# EAGLE design esquema (EAGLE 9.0.0)
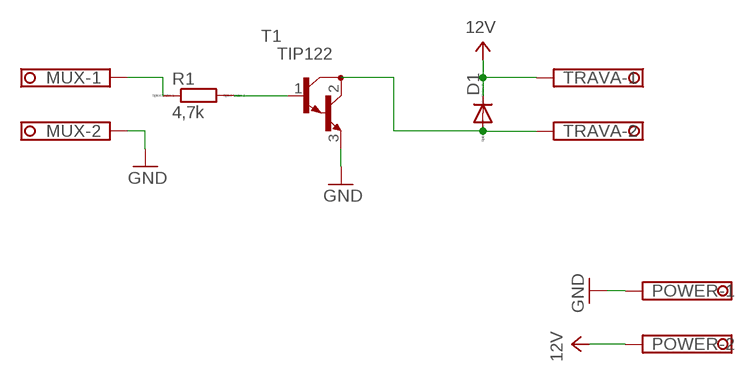
[diagram p0: schematic, sheet 1]

## Parts
D1  1N4004  [DO41-10]
MUX  TERMINAL-BLOCK-3.5MM-2-PIN-ROUND-PAD  [TERMINAL-BLOCK-2-PIN-3.5MM-ROUND-PAD]
POWER  TERMINAL-BLOCK-3.5MM-2-PIN-ROUND-PAD  [TERMINAL-BLOCK-2-PIN-3.5MM-ROUND-PAD]
R1  4,7k  R0207/10  [0207/10]
T1  TIP122  [TO220]
TRAVA  TERMINAL-BLOCK-3.5MM-2-PIN-ROUND-PAD  [TERMINAL-BLOCK-2-PIN-3.5MM-ROUND-PAD]

## Nets
12V: D1.C POWER.2 TRAVA.1
GND: MUX.2 POWER.1 T1.3(E)
N$1: D1.A T1.2(C) TRAVA.2
N$2: R1.2 T1.1(B)
N$3: MUX.1 R1.1

## Library data of the parts
D1 = diode:1N4004: DIODE general purpose rectifier, 1 A
MUX POWER TRAVA = Rembrandt Electronics - Terminal Block 3-5mm v1-0:TERMINAL-BLOCK-3.5MM-2-PIN: Terminal Block 3.5mm Pitch: 3,5 mm Number of pins: 2 Created by Rembrandt Electronics www.rembrandtelectronics.com
R1 = eagle-ltspice:R: RESISTOR, European symbol; SPICEMODEL: NONE; SPICEPREFIX: R
T1 = transistor:TIP122: NPN BIPOLAR DARLINGTON TRANSISTOR

## Board
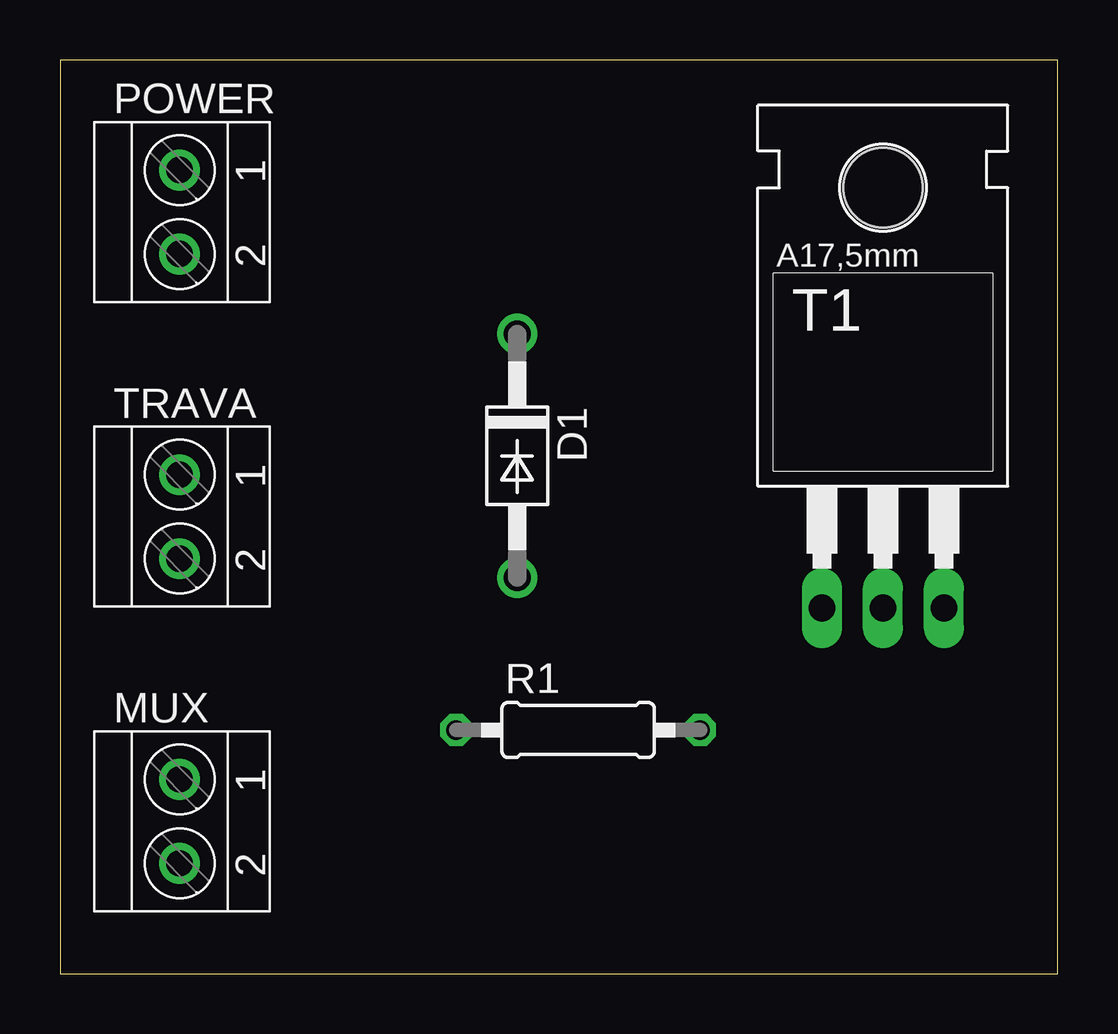
[diagram p1: board, top side]
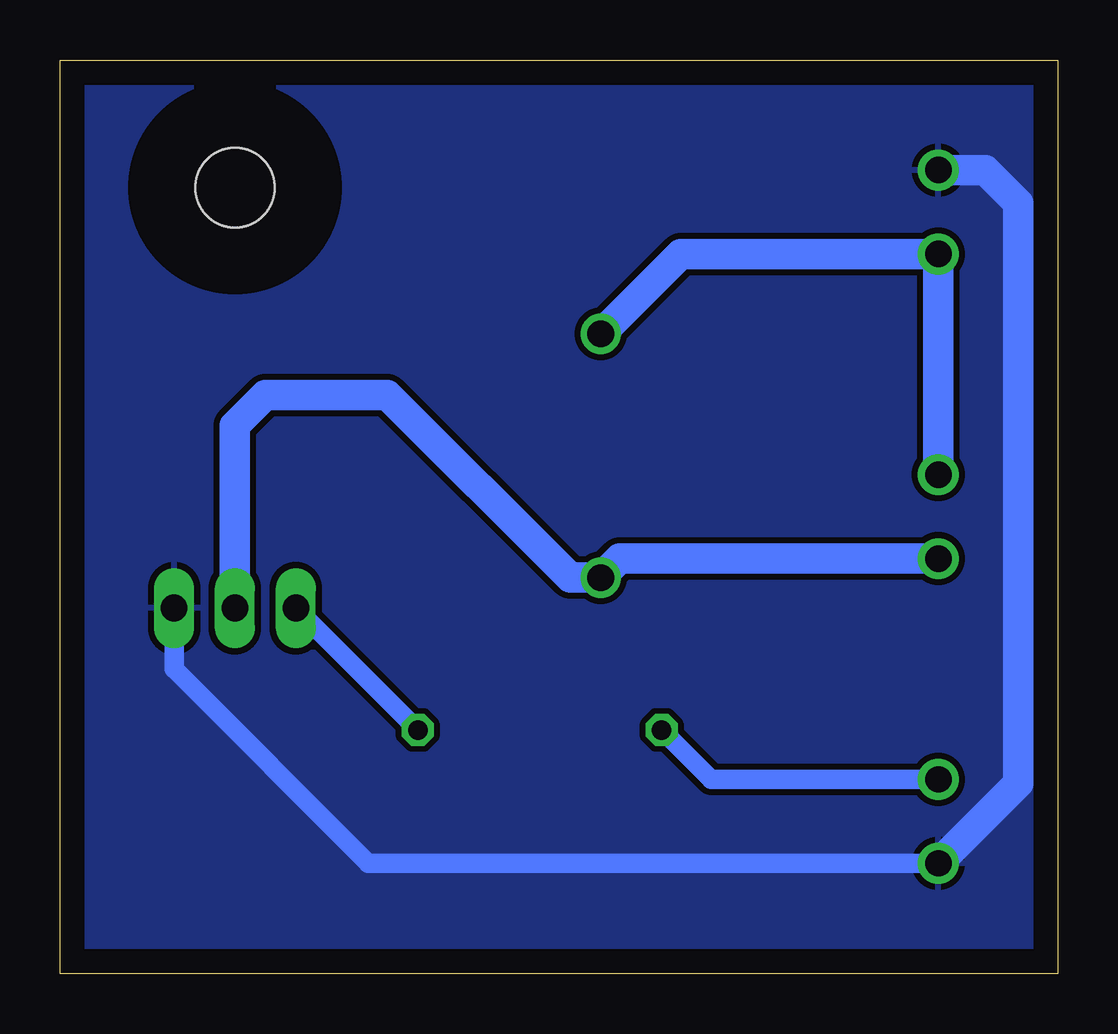
[diagram p2: board, bottom side, seen from below]

Size 41.58 x 38.09 mm. Coordinates in mm from the lower left corner, seen from the top.
Outline: 0,0 41.58,0 41.58,38.09 0,38.09 0,0
Copper layers (1*16): Top 0.035mm / dielectric 1.5mm / Bottom 0.035mm
Design rules "default": minimum track width 6mil, minimum drill 0.35mm, track to track 6mil, track to pad 6mil, pad to pad 6mil, via to via 6mil, smd to smd 6mil, copper to edge 40mil, drill to drill 6mil, minimum pad ring 10mil, minimum via ring 8mil, stop-mask expansion 4mil, vias tented up to drill 0mil, thermal gap 10mil

### Footprints (pad centres in the part's own frame; a part is rotated, then mirrored left to right if it is on the bottom)
DO41-10 = drill 1.118: A 5.08,0; C -5.08,0
TERMINAL-BLOCK-2-PIN-3.5MM-ROUND-PAD = drill 1.1 pad 1.7: 1 -1.75,-0.1; 2 1.75,-0.1
0207/10 = drill 0.813 octagon: 1 -5.08,0; 2 5.08,0
TO220 = drill 1.118 long: 1 -2.54,-6.35; 2 0,-6.35; 3 2.54,-6.35 | hole 3.302: 0,11.176

### Placement (x,y rotation side)
D1  19.05,21.59 270 top
MUX  5.08,6.35 270 top
POWER  5.08,31.75 270 top
R1  21.59,10.16 0 top
T1  34.29,21.59 0 top
TRAVA  5.08,19.05 270 top

### Tracks (layer width: path | path; a pad name or v marks a point on that pad's centre or on a via)
12V
  Bottom 1.27: D1.C 15.72,30 POWER.2 TRAVA.1
GND
  Bottom 0.813: T1.3 36.83,12.7 28.73,4.6 MUX.2
  Bottom 1.27: POWER.1 3.02,33.5 1.65,32.13 1.65,7.93 MUX.2
  pour Bottom (isolate 0.254): 0,38.1 41.91,38.1 41.91,0 0,0
N$1
  Bottom 1.27: TRAVA.2 18.26,17.3 D1.A 20.32,16.51 27.94,24.13 33.02,24.13 34.29,22.86 T1.2
N$2
  Bottom 0.813: R1.2 T1.1
N$3
  Bottom 0.813: MUX.1 14.45,8.1 R1.1